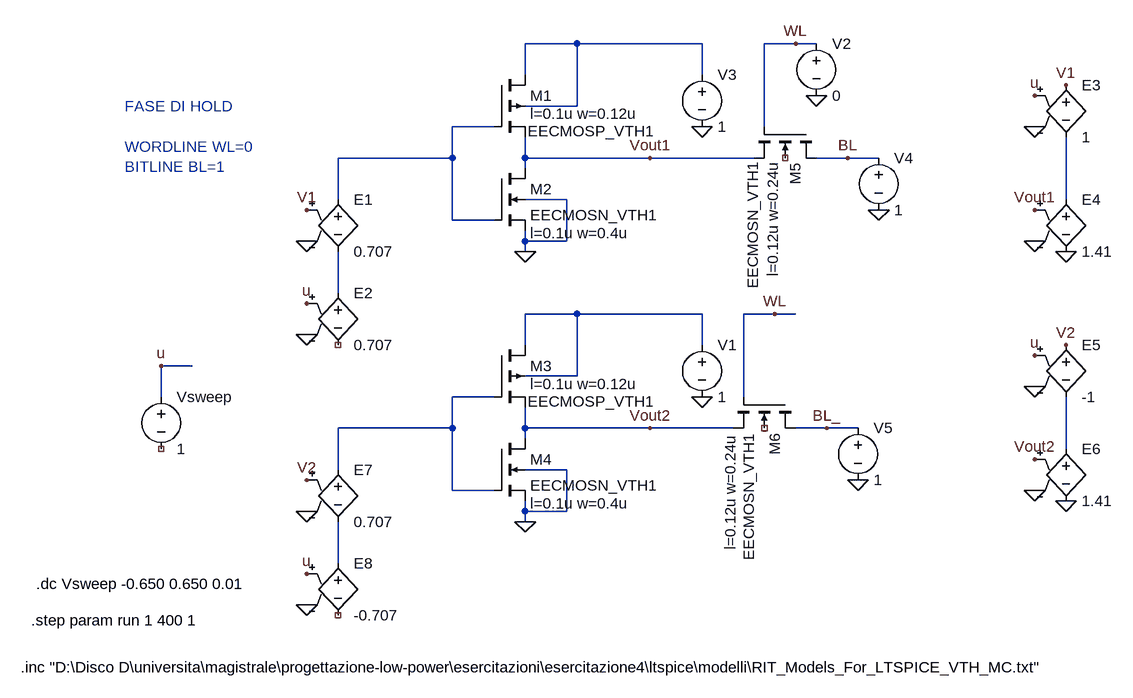
[diagram p0: schematic curva_a_farfalla_hold_montecarlo.asc]
curva_a_farfalla_hold_montecarlo.asc, the LTspice schematic file:
Version 4
SHEET 1 2120 768
WIRE 576 -208 496 -208
WIRE 768 -208 576 -208
WIRE 912 -208 864 -208
WIRE 944 -208 912 -208
WIRE 496 -160 496 -208
WIRE 768 -160 768 -208
WIRE 576 -112 576 -208
WIRE 576 -112 496 -112
WIRE 448 -80 384 -80
WIRE 864 -80 864 -208
WIRE 384 -32 384 -80
WIRE 384 -32 208 -32
WIRE 496 -32 496 -64
WIRE 688 -32 496 -32
WIRE 848 -32 688 -32
WIRE 992 -32 944 -32
WIRE 1040 -32 992 -32
WIRE 496 -16 496 -32
WIRE 208 32 208 -32
WIRE 560 32 496 32
WIRE 1328 32 1328 -64
WIRE 384 64 384 -32
WIRE 448 64 384 64
WIRE 496 96 496 80
WIRE 560 96 560 32
WIRE 560 96 496 96
WIRE 496 112 496 96
WIRE 208 176 208 112
WIRE 576 208 496 208
WIRE 768 208 576 208
WIRE 880 208 832 208
WIRE 912 208 880 208
WIRE 496 256 496 208
WIRE 768 256 768 208
WIRE -16 288 -64 288
WIRE 576 304 576 208
WIRE 576 304 496 304
WIRE -64 336 -64 288
WIRE 448 336 384 336
WIRE 832 336 832 208
WIRE 384 384 384 336
WIRE 384 384 208 384
WIRE 496 384 496 352
WIRE 688 384 496 384
WIRE 816 384 688 384
WIRE 960 384 912 384
WIRE 1008 384 960 384
WIRE 496 400 496 384
WIRE 1328 416 1328 336
WIRE 208 448 208 384
WIRE 560 448 496 448
WIRE 384 480 384 384
WIRE 448 480 384 480
WIRE 496 512 496 496
WIRE 560 512 560 448
WIRE 560 512 496 512
WIRE 496 528 496 512
WIRE 208 592 208 528
FLAG -64 288 u
FLAG 160 96 0
FLAG 160 240 0
FLAG 160 192 u
FLAG 160 48 V1
FLAG 496 112 0
FLAG 768 -80 0
FLAG 688 -32 Vout1
FLAG 1328 112 0
FLAG 1280 96 0
FLAG 1280 -80 0
FLAG 1280 -128 u
FLAG 1280 48 Vout1
FLAG 1328 -144 V1
FLAG 1280 320 0
FLAG 1328 496 0
FLAG 1280 480 0
FLAG 1280 272 u
FLAG 1328 256 V2
FLAG 1280 432 Vout2
FLAG 160 512 0
FLAG 160 656 0
FLAG 160 608 u
FLAG 160 464 V2
FLAG 496 528 0
FLAG 768 336 0
FLAG 688 384 Vout2
FLAG 912 -208 WL
FLAG 992 -32 BL
FLAG 880 208 WL
FLAG 960 384 BL_
FLAG 944 -128 0
FLAG 1040 48 0
FLAG 1008 464 0
SYMBOL voltage -64 320 R0
SYMATTR InstName Vsweep
SYMATTR Value 1
SYMBOL e 208 16 R0
SYMATTR InstName E1
SYMATTR Value 0.707
SYMBOL e 208 160 R0
SYMATTR InstName E2
SYMATTR Value 0.707
SYMBOL pmos4 448 -160 R0
WINDOW 3 52 87 Left 2
WINDOW 123 56 60 Left 2
SYMATTR Value EECMOSP_VTH1
SYMATTR Value2 l=0.1u w=0.12u
SYMATTR InstName M1
SYMBOL nmos4 448 -16 R0
WINDOW 123 56 100 Left 2
SYMATTR Value2 l=0.1u w=0.4u
SYMATTR InstName M2
SYMATTR Value EECMOSN_VTH1
SYMBOL voltage 768 -176 R0
WINDOW 123 0 0 Left 0
WINDOW 39 0 0 Left 0
SYMATTR InstName V3
SYMATTR Value 1
SYMBOL e 1328 -160 R0
SYMATTR InstName E3
SYMATTR Value 1
SYMBOL e 1328 16 R0
SYMATTR InstName E4
SYMATTR Value 1.41
SYMBOL e 1328 240 R0
SYMATTR InstName E5
SYMATTR Value -1
SYMBOL e 1328 400 R0
SYMATTR InstName E6
SYMATTR Value 1.41
SYMBOL e 208 432 R0
SYMATTR InstName E7
SYMATTR Value 0.707
SYMBOL e 208 576 R0
SYMATTR InstName E8
SYMATTR Value -0.707
SYMBOL pmos4 448 256 R0
WINDOW 3 52 87 Left 2
WINDOW 123 56 60 Left 2
SYMATTR Value EECMOSP_VTH1
SYMATTR Value2 l=0.1u w=0.12u
SYMATTR InstName M3
SYMBOL nmos4 448 400 R0
WINDOW 123 56 100 Left 2
SYMATTR Value2 l=0.1u w=0.4u
SYMATTR InstName M4
SYMATTR Value EECMOSN_VTH1
SYMBOL voltage 768 240 R0
WINDOW 123 0 0 Left 0
WINDOW 39 0 0 Left 0
SYMATTR InstName V1
SYMATTR Value 1
SYMBOL nmos4 944 -80 R90
WINDOW 123 51 67 Left 2
WINDOW 3 54 98 Left 2
SYMATTR Value2 l=0.12u w=0.24u
SYMATTR InstName M5
SYMATTR Value EECMOSN_VTH1
SYMBOL voltage 944 -224 R0
SYMATTR InstName V2
SYMATTR Value 0
SYMBOL voltage 1040 -48 R0
WINDOW 123 0 0 Left 0
WINDOW 39 0 0 Left 0
SYMATTR InstName V4
SYMATTR Value 1
SYMBOL nmos4 912 336 R90
WINDOW 123 56 100 Left 2
SYMATTR Value2 l=0.12u w=0.24u
SYMATTR InstName M6
SYMATTR Value EECMOSN_VTH1
SYMBOL voltage 1008 368 R0
WINDOW 123 0 0 Left 0
WINDOW 39 0 0 Left 0
SYMATTR InstName V5
SYMATTR Value 1
TEXT -280 752 Left 2 !.inc "D:\\Disco D\\universita\\magistrale\\progettazione-low-power\\esercitazioni\\esercitazione4\\ltspice\\modelli\\RIT_Models_For_LTSPICE_VTH_MC.txt"
TEXT -264 680 Left 2 !.step param run 1 400 1
TEXT -256 624 Left 2 !.dc Vsweep -0.650 0.650 0.01
TEXT -120 -112 Left 2 ;FASE DI HOLD\n \nWORDLINE WL=0\nBITLINE BL=1

The netlist it stands for:
* curva_a_farfalla_hold_montecarlo.asc
Vsweep u NC_01 1
E1 N002 N004 V1 0 0.707
E2 N004 NC_02 u 0 0.707
M1 N001 N002 Vout1 N001 EECMOSP_VTH1 l=0.1u w=0.12u
M2 Vout1 N002 0 0 EECMOSN_VTH1 l=0.1u w=0.4u
V3 N001 0 1
E3 V1 N003 u 0 1
E4 N003 0 Vout1 0 1.41
E5 V2 N007 u 0 -1
E6 N007 0 Vout2 0 1.41
E7 N006 N008 V2 0 0.707
E8 N008 NC_03 u 0 -0.707
M3 N005 N006 Vout2 N005 EECMOSP_VTH1 l=0.1u w=0.12u
M4 Vout2 N006 0 0 EECMOSN_VTH1 l=0.1u w=0.4u
V1 N005 0 1
M5 BL WL Vout1 NC_04 EECMOSN_VTH1 l=0.12u w=0.24u
V2 WL 0 0
V4 BL 0 1
M6 BL_ WL Vout2 NC_05 EECMOSN_VTH1 l=0.12u w=0.24u
V5 BL_ 0 1
.model NMOS NMOS
.model PMOS PMOS
.lib standard.mos
.inc "D:\Disco D\universita\magistrale\progettazione-low-power\esercitazioni\esercitazione4\ltspice\modelli\RIT_Models_For_LTSPICE_VTH_MC.txt"
.step param run 1 400 1
.dc Vsweep -0.650 0.650 0.01
* FASE DI HOLD
* WORDLINE WL=0
* BITLINE BL=1
.backanno
.end